# Altium schematic sheet pca10143_sheet3_interface_mcu.SchDoc: PCA10143 - Interface MCU
size A3; Organization: Nordic Semiconductor; DocumentNumber: 3; Revision: 0.7.2; SheetNumber: 3; SheetTotal: 7; CompanyName: Nordic Semiconductor
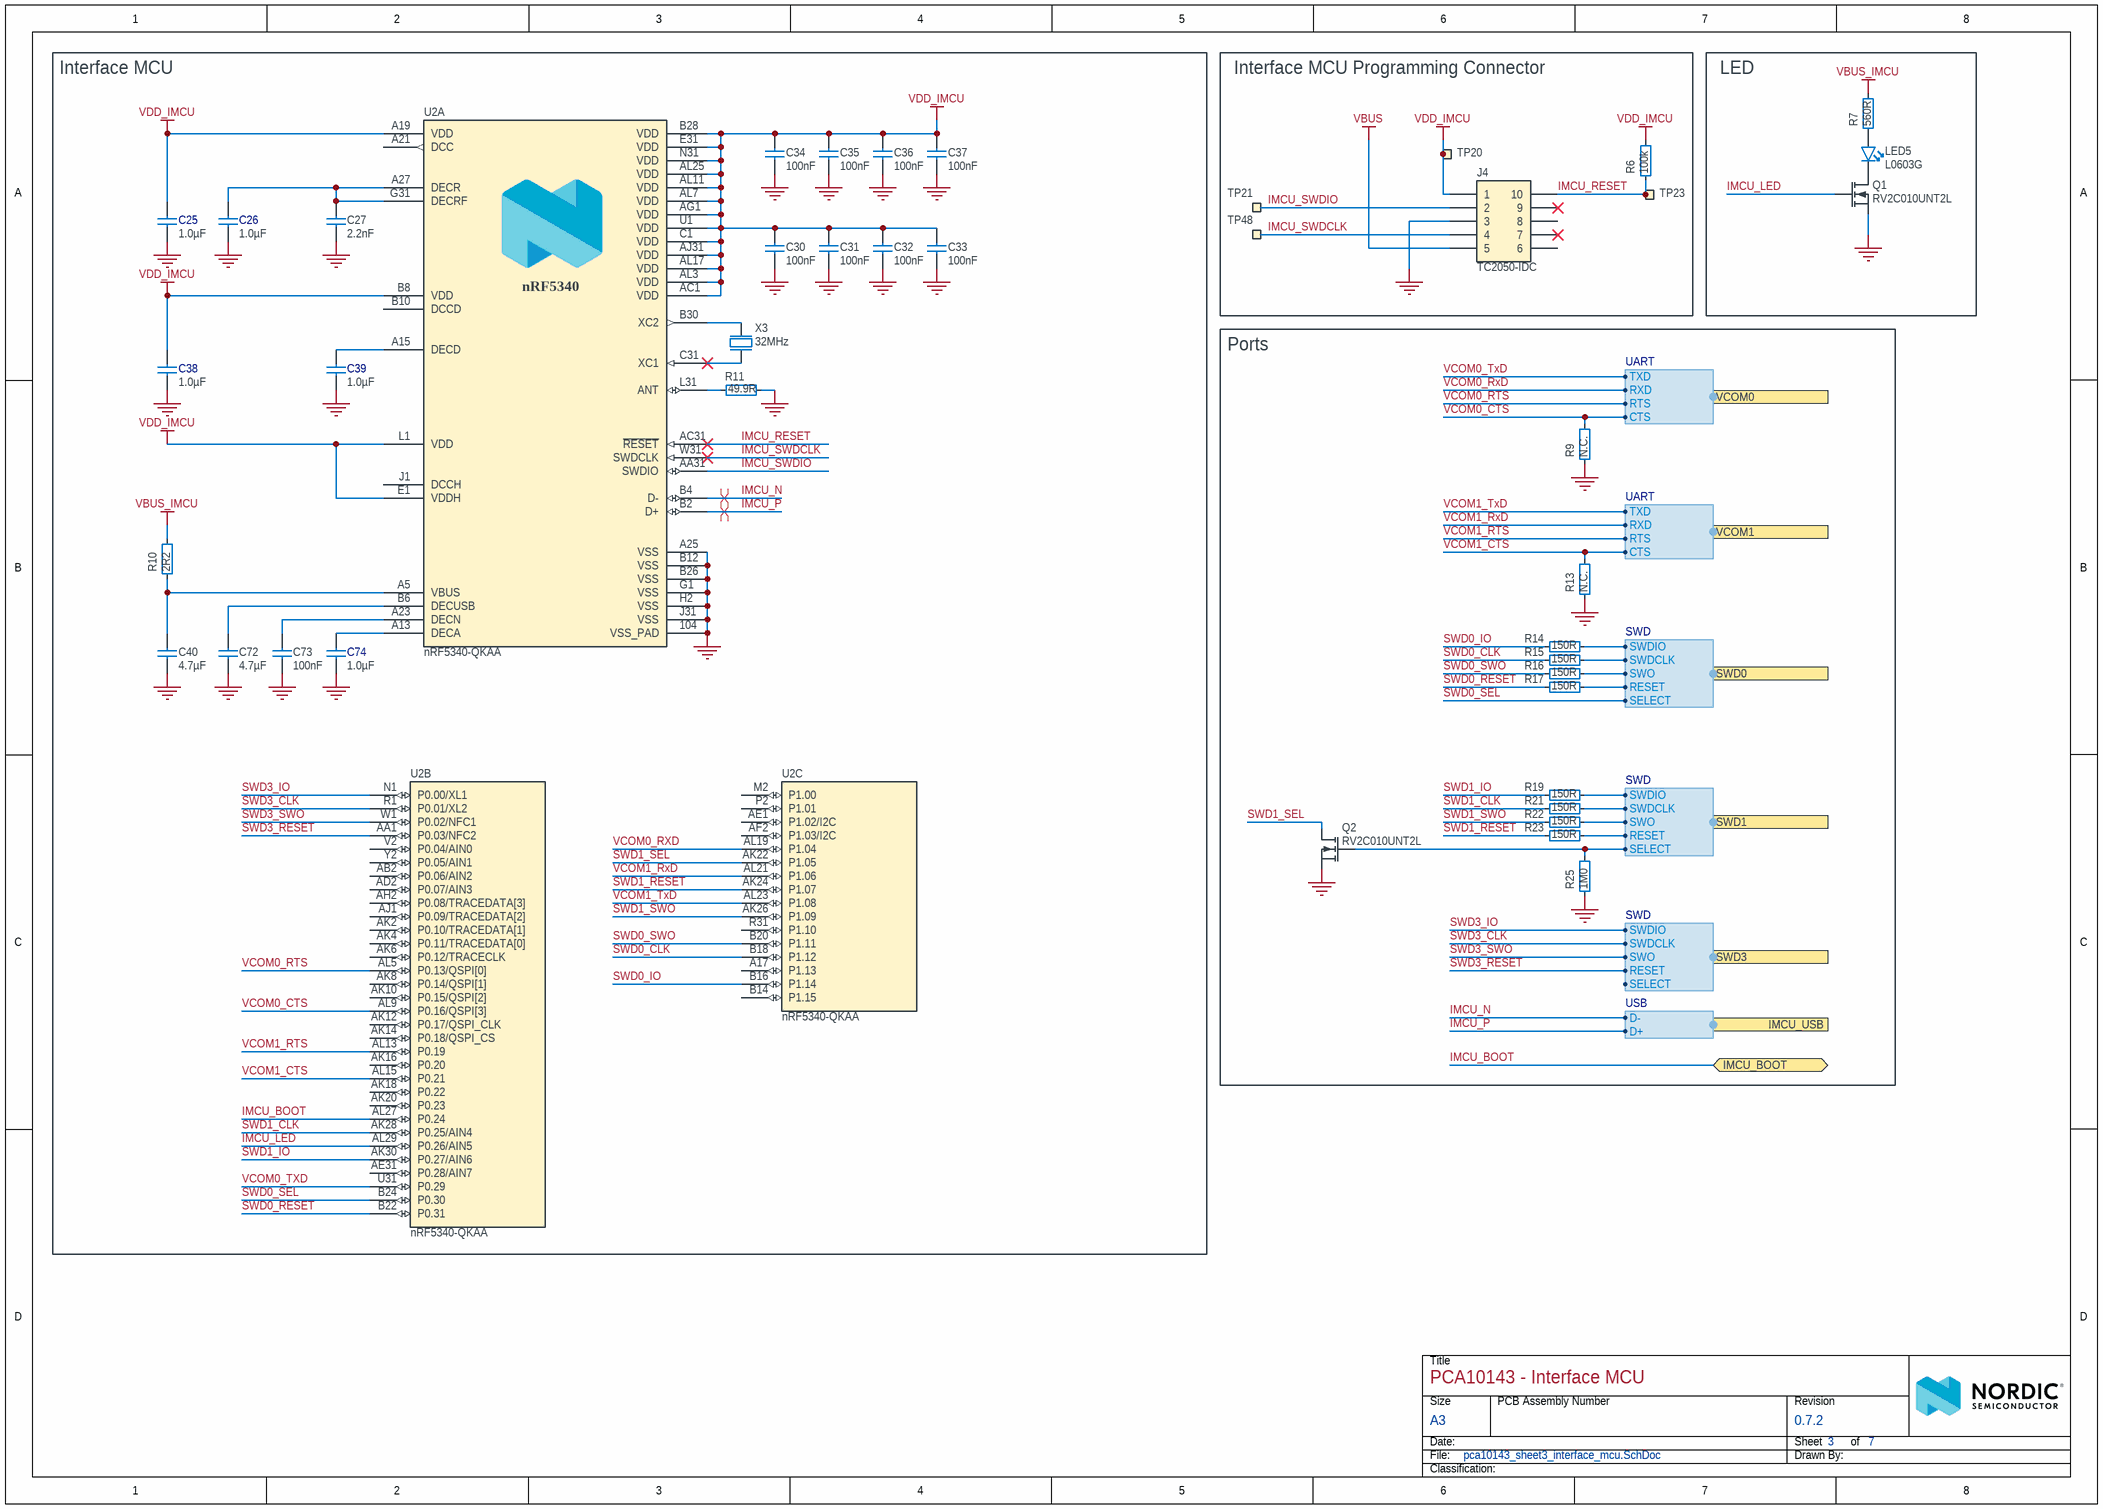
[diagram p0: pca10143_sheet3_interface_mcu.SchDoc]

## Parts
C25  1.0µF  [CAPC1005X04L]
C26  1.0µF  [CAPC1005X04L]
C27  2.2nF  [CAPC0603X03L_C]
C30  100nF  [CAPC0603X03L_C]
C31  100nF  [CAPC0603X03L_C]
C32  100nF  [CAPC0603X03L_C]
C33  100nF  [CAPC0603X03L_C]
C34  100nF  [CAPC0603X03L_C]
C35  100nF  [CAPC0603X03L_C]
C36  100nF  [CAPC0603X03L_C]
C37  100nF  [CAPC0603X03L_C]
C38  1.0µF  [CAPC1005X04L]
C39  1.0µF  [CAPC1005X04L]
C40  4.7µF  [CAPC1608X06L]
C72  4.7µF  [CAPC1608X06L]
C73  100nF  [CAPC0603X03L_C]
C74  1.0µF  [CAPC1005X04L]
J4  TC2050-IDC  [TC2050-IDC-NLFP]  (no BOM)
LED5  L0603G  [LED_0603_G]
Q1  RV2C010UNT2L  [DFN65P100X40-3L]
Q2  RV2C010UNT2L  [DFN65P100X40-3L]
R6  100k  [RESC0603X03L_C]
R7  560R  [RESC0603X03L_C]
R9  N.C.  [RESC0603X03L_C_NC]
R10  2R2  [RESC0603X03L_C]
R11  49.9R  [RESC0603X03L_C]
R13  N.C.  [RESC0603X03L_C_NC]
R14  150R  [RESC0603X03L_C]
R15  150R  [RESC0603X03L_C]
R16  150R  [RESC0603X03L_C]
R17  150R  [RESC0603X03L_C]
R19  150R  [RESC0603X03L_C]
R21  150R  [RESC0603X03L_C]
R22  150R  [RESC0603X03L_C]
R23  150R  [RESC0603X03L_C]
R25  1M0  [RESC0603X03L_C]
TP20  Ø1.5mm,SMD  [TP_SMD_D1.5mm]  (value not drawn)  (no BOM)
TP21  Ø1.5mm,SMD  [TP_SMD_D1.5mm]  (value not drawn)  (no BOM)
TP23  Ø1.5mm,SMD  [TP_SMD_D1.5mm]  (value not drawn)  (no BOM)
TP48  Ø1.5mm,SMD  [TP_SMD_D1.5mm]  (value not drawn)  (no BOM)
U2  nRF5340-QKAA  [AQFN40P700X700X85_HS-99N]  (parts A,B,C of 3)
X3  32MHz  [BT-XTAL_2016]

## Blocks framed on the sheet
Interface MCU: C25-C27 C30-C40 C72-C74 R10 R11 U2 X3
Interface MCU Programming Connector: J4 R6 TP20 TP21 TP23 TP48
LED: LED5 Q1 R7
Ports: Q2 R9 R13-R17 R19 R21-R23 R25

## Ports
IMCU_BOOT (bidir), IMCU_USB (harness USB), SWD0 (harness SWD), SWD1 (harness SWD), SWD3 (harness SWD), VCOM0 (harness UART), VCOM1 (harness UART)

## Harnesses
SWD: SWDIO, SWDCLK, SWO, RESET, SELECT
UART: RTS, CTS, RXD, TXD
USB: D+, D-

## Nets
GND: C25.2 C26.1 C27.2 C30.2 C31.2 C32.2 C33.2 C34.2 C35.2 C36.2 C37.2 C38.1 C39.1 C40.2 C72.2 C73.2 C74.1 J4.3 Q1.2(S) Q2.2(S) R9.2 R11.2 R13.2 R25.2 U2.104(VSS_PAD) U2.A25(VSS) U2.B12(VSS) U2.B26(VSS) U2.G1(VSS) U2.H2(VSS) U2.J31(VSS) X3.2(GND) X3.4(GND)
VBUS: J4.5
VBUS_IMCU: R7.2 R10.1
VDD_IMCU: C25.1 C30.1 C31.1 C32.1 C33.1 C34.1 C35.1 C36.1 C37.1 C38.2 J4.1 R6.2 TP20.1 U2.A19(VDD) U2.AC1(VDD) U2.AG1(VDD) U2.AJ31(VDD) U2.AL3(VDD) U2.AL7(VDD) U2.AL11(VDD) U2.AL17(VDD) U2.AL25(VDD) U2.B8(VDD) U2.B28(VDD) U2.C1(VDD) U2.E1(VDDH) U2.E31(VDD) U2.L1(VDD) U2.N31(VDD) U2.U1(VDD)
IMCU_BOOT: U2.AL27(P0.24) ; port IMCU_BOOT
IMCU_LED: Q1.1(G) U2.AL29(P0.26/AIN5)
IMCU_N: U2.B4(D-) ; port IMCU_USB.D-
IMCU_P: U2.B2(D+) ; port IMCU_USB.D+
IMCU_RESET: J4.10 R6.1 TP23.1 U2.AC31(~{RESET})
IMCU_SWDCLK: J4.4 TP48.1 U2.W31(SWDCLK)
IMCU_SWDIO: J4.2 TP21.1 U2.AA31(SWDIO)
SWD0_CLK: R15.1 U2.B18(P1.12)
SWD0_IO: R14.1 U2.B16(P1.14)
SWD0_RESET: R17.1 U2.B22(P0.31)
SWD0_SEL: U2.B24(P0.30) ; port SWD0.SELECT
SWD0_SWO: R16.1 U2.B20(P1.11)
SWD1_CLK: R21.1 U2.AK28(P0.25/AIN4)
SWD1_IO: R19.1 U2.AK30(P0.27/AIN6)
SWD1_RESET: R23.1 U2.AK24(P1.07)
SWD1_SEL: Q2.3(D) U2.AK22(P1.05)
SWD1_SWO: R22.1 U2.AK26(P1.09)
SWD3_CLK: U2.R1(P0.01/XL2) ; port SWD3.SWDCLK
SWD3_IO: U2.N1(P0.00/XL1) ; port SWD3.SWDIO
SWD3_RESET: U2.AA1(P0.03/NFC2) ; port SWD3.RESET
SWD3_SWO: U2.W1(P0.02/NFC1) ; port SWD3.SWO
VCOM0_CTS: R9.1 U2.AL9(P0.16/QSPI[3]) ; port VCOM0.CTS
VCOM0_RTS: U2.AL5(P0.13/QSPI[0]) ; port VCOM0.RTS
VCOM0_RXD: U2.AL19(P1.04) ; port VCOM0.RXD
VCOM0_TXD: U2.U31(P0.29) ; port VCOM0.TXD
VCOM1_CTS: R13.1 U2.AL15(P0.21) ; port VCOM1.CTS
VCOM1_RTS: U2.AL13(P0.19) ; port VCOM1.RTS
VCOM1_RxD: U2.AL21(P1.06) ; port VCOM1.RXD
VCOM1_TxD: U2.AL23(P1.08) ; port VCOM1.TXD
NetC26_2: C26.2 C27.1 U2.A27(DECR) U2.G31(DECRF)
NetC39_2: C39.2 U2.A15(DECD)
NetC40_1: C40.1 R10.2 U2.A5(VBUS)
NetC72_1: C72.1 U2.B6(DECUSB)
NetC73_1: C73.1 U2.A23(DECN)
NetC74_2: C74.2 U2.A13(DECA)
NetLED5_1: LED5.1(C) Q1.3(D)
NetLED5_2: LED5.2(A) R7.1
NetQ2_1: Q2.1(G) R25.1 ; port SWD1.SELECT
NetR11_1: R11.1 U2.L31(ANT)
NetR14_2: R14.2 ; port SWD0.SWDIO
NetR15_2: R15.2 ; port SWD0.SWDCLK
NetR16_2: R16.2 ; port SWD0.SWO
NetR17_2: R17.2 ; port SWD0.RESET
NetR19_2: R19.2 ; port SWD1.SWDIO
NetR21_2: R21.2 ; port SWD1.SWDCLK
NetR22_2: R22.2 ; port SWD1.SWO
NetR23_2: R23.2 ; port SWD1.RESET
NetU2_B30: U2.B30(XC2) X3.3(out)
NetU2_C31: U2.C31(XC1) X3.1(inp)

Not connected (* = marked no-connect by the designer): J4 6 7* 8 9*; U2 A17(P1.13) A21(DCC) AB2(P0.06/AIN2) AD2(P0.07/AIN3) AE1(P1.02/I2C) AE31(P0.28/AIN7) AF2(P1.03/I2C) AG31(N.C.) AH2(P0.08/TRACEDATA[3]) AJ1(P0.09/TRACEDATA[2]) AK2(P0.10/TRACEDATA[1]) AK4(P0.11/TRACEDATA[0]) AK6(P0.12/TRACECLK) AK8(P0.14/QSPI[1]) AK10(P0.15/QSPI[2]) AK12(P0.17/QSPI_CLK) AK14(P0.18/QSPI_CS) AK16(P0.20) AK18(P0.22) AK20(P0.23) B10(DCCD) B14(P1.15) D2(N.C.) F2(N.C.) J1(DCCH) M2(P1.00) P2(P1.01) R31(P1.10) T2(N.C.) V2(P0.04/AIN0) Y2(P0.05/AIN1)

## Layout directives
differential pair: IMCU_N, IMCU_P

## Notes on the sheet
- Title
- Size
- Date:
- File:
- A3
- PCB Assembly Number
- Sheet         of
- Drawn By:
- Revision
- Classification:
- (in symbol nRF5340-QKAAD0, part A) nRF5340

## Library data of the parts
C25 C26 C38 C39 C74 = C0402-1µ0-6.3V-X5R-5%: Capacitor, X5R, ±5%, 6.3V; Manufacturer: N.A.; Part number IPS: 00000007786, 00000003457; Part number NEMS: 100200190; Pad Count: 2; Artikkelnr Noca: 20039235; Component Status: Active; Part Number: C0402-1µ0-6.3V-X5R-5%; Value: 1.0µF; Footprint Doc: 0402; Component Class: Capacitors; Author: rsk; PartId: 100200190; Manufacturer Part Number: N.A.; ComponentLink1URL: N.A.; ComponentLink1Description: Datasheet; ComponentLink2URL: N.A.; ComponentLink2Description: Supplier link; HelpURL: N.A.; LatestRevisionDate: 2021-07-22; Published: 2009-05-08; Note: 6.3V; Supplier 1: Digi-Key; Supplier Part Number 1: 1276-1444-1-ND; Supplier 2: N.A.; Supplier Part Number 2: N.A.; Part number Norautron: N.A.
C27 = C0201-2n2: Capacitor, X7R, ±10%, 10V; Manufacturer: N.A.; Part number IPS: 00000001778; Part number Norautron: 26470002; Part number NEMS: 100200060; Pad Count: 2; Component Status: Active; Part Number: C0201-2n2; Value: 2.2nF; Footprint Doc: 0201; Component Class: Capacitors; Author: rsk; PartId: 100200060; Manufacturer Part Number: N.A.; ComponentLink1URL: N.A.; ComponentLink1Description: Datasheet; ComponentLink2URL: N.A.; ComponentLink2Description: Supplier link; HelpURL: N.A.; LatestRevisionDate: 2014-11-13; Published: 2014-11-13; Note: 10V; Supplier 1: N.A.; Supplier Part Number 1: N.A.; Supplier 2: N.A.; Supplier Part Number 2: N.A.; Artikkelnr Noca: N.A.
C30-C37 C73 = C0201-100n: Capacitor, X5R, ±10%; Manufacturer: N.A.; Part number IPS: 00000001248, 00000002505; Part number Norautron: 262071862; Part number NEMS: 100200078; Pad Count: 2; Note: 16V; Component Status: Active; Part Number: C0201-100n; Value: 100nF; Footprint Doc: 0201; Component Class: Capacitors; Author: rsk; PartId: 100200078; Manufacturer Part Number: N.A.; ComponentLink1URL: N.A.; ComponentLink1Description: Datasheet; ComponentLink2URL: N.A.; ComponentLink2Description: Supplier link; HelpURL: N.A.; LatestRevisionDate: 2017-11-09; Published: 2014-11-13; Supplier 1: N.A.; Supplier Part Number 1: N.A.; Supplier 2: N.A.; Supplier Part Number 2: N.A.; Artikkelnr Noca: N.A.
C40 = C0603-4µ7-10V-X7S: Capacitor, X7S, ±10%, 10V; Manufacturer: N.A.; Part number IPS: 00000001779; Part number NEMS: 100200351; Pad Count: 2; Artikkelnr Noca: 20030013; Component Status: Active; Part Number: C0603-4µ7-10V-X7S; Value: 4.7µF; Footprint Doc: 0603; Component Class: Capacitors; Author: rsk; PartId: 100200351; Manufacturer Part Number: N.A.; ComponentLink1URL: N.A.; ComponentLink1Description: Datasheet; ComponentLink2URL: N.A.; ComponentLink2Description: Supplier link; HelpURL: N.A.; LatestRevisionDate: 2016-08-15; Published: 2016-08-15; Note: 10V; Supplier 1: Digi-Key; Supplier Part Number 1: 445-14258-1-ND; Supplier 2: N.A.; Supplier Part Number 2: N.A.; Part number Norautron: N.A.
C72 = C0603-4µ7-6.3V-X7R: Capacitor, X7R, ±10%, 6.3V; Manufacturer: Samsung Electro-Mechanics America; Manufacturer Part Number: CL10B475KQ8NQNC; Part number IPS: 00000002541; Part number Norautron: N.A.; Part number NEMS: 100200350; Pad Count: 2; Artikkelnr Noca: 20039473; Component Status: Active; Part Number: C0603-4µ7-6.3V-X7R; Value: 4.7µF; Footprint Doc: 0603; Component Class: Capacitors; Author: rsk; PartId: 100200350; ComponentLink1URL: N.A.; ComponentLink1Description: Datasheet; ComponentLink2URL: N.A.; ComponentLink2Description: Supplier link; HelpURL: http://media.digikey.com/pdf/Data%20Sheets/Samsung%20PDFs/CL10B475KQ8NQNC_Spec.pdf; LatestRevisionDate: 2015-06-10; Published: 2015-06-10; Note: 6.3V; Supplier 1: Digi-Key; Supplier Part Number 1: 1276-2087-1-ND; Supplier 2: N.A.; Supplier Part Number 2: N.A.
J4 = TC2050-IDC-NLFP: CBL PLUG-OF-NAILS 10-PIN; Manufacturer: Tag-Connect LLC; Part number NEMS: 100500463; Artikkelnr Noca: N.A.; Pad Count: 10; Component Status: Active; Part Number: TC2050-IDC-NLFP; Manufacturer Part Number: TC2050-IDC-NLFP; LatestRevisionDate: 2012-11-21; Published: 2012-11-21; Value: TC2050-IDC; Footprint Doc: TC2050-IDC-NLFP; Part number IPS: N.A.; ComponentLink1URL: N.A.; ComponentLink1Description: Datasheet; ComponentLink2URL: N.A.; ComponentLink2Description: Supplier link; HelpURL: http://www.tag-connect.com/Materials/TC2050-IDC%20Datasheet.pdf; Supplier 1: Digi-Key; Supplier Part Number 1: TC2050-IDC-NL-ND; Supplier 2: N.A.; Supplier Part Number 2: N.A.; Component Class: Connectors; Note: N.A.; PartId: 100500463; Author: rsk; Part number Norautron: N.A.
LED5 = VS 25C7M5: LED, Green, 0603, 573nm, Vf=2.0V, 24mcd, - 40 to +85°C; Manufacturer: Victory Electronics; Part number IPS: 00000001274, 00000009961; Part number Norautron: 26313411; Part number NEMS: 101400097; Note: N.A.; Artikkelnr Noca: 13019193; Pad Count: 2; Component Status: Active; Part Number: VS 25C7M5; Manufacturer Part Number: VS 25C7M5; Footprint Doc: 0603; LatestRevisionDate: 2020-10-23; Published: 2017-08-21; Value: L0603G; ComponentLink1URL: N.A.; ComponentLink1Description: Datasheet; ComponentLink2URL: N.A.; ComponentLink2Description: Supplier link; HelpURL: \\hizz\pro\app9717\Datasheet\optoelectronics\Victory Electronics\VS 25C7M5.pdf; Supplier 1: EC Partner; Supplier Part Number 1: N.A.; Supplier 2: N.A.; Supplier Part Number 2: N.A.; PartId: 101400097; Component Class: Optoelectronics; Author: rsk
Q1 Q2 = RV2C010UNT2L: N-Channel MOSFET, 20V, 1A, 470mOhm, 400mW; Manufacturer: Rohm Semiconductor; Part number IPS: 00000009976; Part number Norautron: 26320026; Part number NEMS: 101300132; Note: N.A.; Artikkelnr Noca: 35010020; Pad Count: 3; Component Status: Active; Part Number: RV2C010UNT2L; Manufacturer Part Number: RV2C010UNT2L; ComponentLink1URL: N.A.; ComponentLink1Description: Datasheet; ComponentLink2URL: N.A.; ComponentLink2Description: Supplier link; HelpURL: http://rohmfs.rohm.com/en/products/databook/datasheet/discrete/transistor/mosfet/rv2c010unt2l-e.pdf; Footprint Doc: DFN-3; LatestRevisionDate: 2016-08-09; Published: 2016-08-09; Value: RV2C010UNT2L; Supplier 1: Digi-Key; Supplier Part Number 1: RV2C010UNT2LCT-ND; Supplier 2: Mouser; Supplier Part Number 2: 755-RV2C010UNT2L; PartId: 101300132; Component Class: Semiconductors; Author: rsk
R6 = R0201-100k: Resistor, ±1%, 0.05W; Manufacturer: N.A.; Part number IPS: 00000001419; Part number Norautron: 26108487; Part number NEMS: 100100080; Note: Chip Res 1%; Pad Count: 2; Component Status: Active; Part Number: R0201-100k; Manufacturer Part Number: N.A.; ComponentLink1URL: N.A.; ComponentLink1Description: Datasheet; ComponentLink2URL: N.A.; ComponentLink2Description: Supplier link; HelpURL: N.A.; Footprint Doc: 0201; LatestRevisionDate: 2014-11-13; Published: 2014-11-13; Value: 100k; Artikkelnr Noca: N.A.; Supplier 1: N.A.; Supplier Part Number 1: N.A.; Supplier 2: N.A.; Supplier Part Number 2: N.A.; Component Class: Resistors; PartId: 100100080; Author: rsk
R7 = R0201-560: Resistor, ±1%, 0.05W; Manufacturer: N.A.; Part number NEMS: 100100038; Note: Chip Res 1%; Pad Count: 2; Component Status: Active; Part Number: R0201-560; Manufacturer Part Number: N.A.; ComponentLink1URL: N.A.; ComponentLink1Description: Datasheet; ComponentLink2URL: N.A.; ComponentLink2Description: Supplier link; HelpURL: N.A.; Footprint Doc: 0201; LatestRevisionDate: 2014-11-13; Published: 2014-11-13; Value: 560R; Supplier 1: N.A.; Supplier Part Number 1: N.A.; Supplier 2: N.A.; Supplier Part Number 2: N.A.; Artikkelnr Noca: N.A.; Part number IPS: N.A.; PartId: 100100038; Component Class: Resistors; Author: rsk; Part number Norautron: N.A.
R9 R13 = R0201-N.C.: Not mounted; Manufacturer: N.A.; Part number NEMS: 100100107; Assembly: Not mounted; Note: Chip Res; Pad Count: 2; Component Status: Active; Part Number: R0201-N.C.; Manufacturer Part Number: N.A.; ComponentLink1URL: N.A.; ComponentLink1Description: Datasheet; ComponentLink2URL: N.A.; ComponentLink2Description: Supplier link; HelpURL: N.A.; Footprint Doc: 0201; LatestRevisionDate: 2014-11-13; Published: 2014-11-13; Value: N.C.; Supplier 1: N.A.; Supplier Part Number 1: N.A.; Supplier 2: N.A.; Supplier Part Number 2: N.A.; Artikkelnr Noca: N.A.; Part number IPS: N.A.; PartId: 100100107; Component Class: Resistors; Author: rsk; Part number Norautron: N.A.
R10 = R0201-2R2: Resistor, ±1%, 0.05W; Manufacturer: N.A.; Part number Norautron: 26470029; Part number NEMS: 100100006; Pad Count: 2; Note: Chip Res 1%; Component Status: Active; Part Number: R0201-2R2; Footprint Doc: 0201; Value: 2R2; Component Class: Resistors; Author: rsk; PartId: 100100006; Manufacturer Part Number: N.A.; ComponentLink1URL: N.A.; ComponentLink1Description: Datasheet; ComponentLink2URL: N.A.; ComponentLink2Description: Supplier link; HelpURL: N.A.; LatestRevisionDate: 2014-11-13; Published: 2014-11-13; Supplier 1: N.A.; Supplier Part Number 1: N.A.; Supplier 2: N.A.; Supplier Part Number 2: N.A.; Artikkelnr Noca: N.A.; Part number IPS: N.A.
R11 = R0201-49R9: Resistor, ±1%, 0.05W; Manufacturer: N.A.; Part number Norautron: 26107071; Part number NEMS: 100100612; Pad Count: 2; Note: Chip Res 1%; Component Status: Active; Part Number: R0201-49R9; PartId: 100100612; Component Class: Resistors; Author: getr; Manufacturer Part Number: N.A.; ComponentLink1URL: N.A.; ComponentLink1Description: Datasheet; ComponentLink2URL: N.A.; ComponentLink2Description: Supplier link; HelpURL: N.A.; Footprint Doc: 0201; LatestRevisionDate: 2021-04-15; Published: 2021-04-15; Value: 49.9R; Supplier 1: N.A.; Supplier Part Number 1: N.A.; Supplier 2: N.A.; Supplier Part Number 2: N.A.; Artikkelnr Noca: N.A.; Part number IPS: N.A.
R14-R17 R19 R21-R23 = R0201-150: Resistor, ±1%, 0.05W; Manufacturer: N.A.; Part number IPS: 00000001420; Part number NEMS: 100100029; Note: Chip Res 1%; Pad Count: 2; Component Status: Active; Part Number: R0201-150; Manufacturer Part Number: N.A.; ComponentLink1URL: N.A.; ComponentLink1Description: Datasheet; ComponentLink2URL: N.A.; ComponentLink2Description: Supplier link; HelpURL: N.A.; Footprint Doc: 0201; LatestRevisionDate: 2014-11-13; Published: 2014-11-13; Value: 150R; Artikkelnr Noca: N.A.; Supplier 1: N.A.; Supplier Part Number 1: N.A.; Supplier 2: N.A.; Supplier Part Number 2: N.A.; PartId: 100100029; Component Class: Resistors; Author: rsk; Part number Norautron: N.A.
R25 = R0201-1M0: Resistor, ±1%, 0.05W; Manufacturer: N.A.; Part number IPS: 00000001418; Part number Norautron: 26107108; Part number NEMS: 100100093; Note: Chip Res 1%; Pad Count: 2; Component Status: Active; Part Number: R0201-1M0; Manufacturer Part Number: N.A.; ComponentLink1URL: N.A.; ComponentLink1Description: Datasheet; ComponentLink2URL: N.A.; ComponentLink2Description: Supplier link; HelpURL: N.A.; Footprint Doc: 0201; LatestRevisionDate: 2014-11-13; Published: 2014-11-13; Value: 1M0; Supplier 1: N.A.; Supplier Part Number 1: N.A.; Supplier 2: N.A.; Supplier Part Number 2: N.A.; Artikkelnr Noca: N.A.; PartId: 100100093; Component Class: Resistors; Author: rsk
TP20 TP21 TP23 TP48 = TP_SMD_Ø1.5MM: 1.5mm circular SMD testpad; Manufacturer: Nordic Semiconductor; Manufacturer Part Number: N.A.; Part number NEMS: 100500477; Pad Count: 1; Component Status: Active; Part Number: TP_SMD_Ø1.5MM; ComponentLink1URL: N.A.; ComponentLink1Description: Datasheet; ComponentLink2URL: N.A.; ComponentLink2Description: Supplier link; HelpURL: N.A.; Footprint Doc: TP_SMD_Ø1.5mm; LatestRevisionDate: 2021-03-05; Published: 2016-06-02; Value: Ø1.5mm,SMD; Note: N.A.; Artikkelnr Noca: N.A.; Part number IPS: N.A.; Supplier 1: N.A.; Supplier Part Number 1: N.A.; Supplier 2: N.A.; Supplier Part Number 2: N.A.; Component Class: Connectors; PartId: 100500477; Author: rsk; Part number Norautron: N.A.
U2 = nRF5340-QKAAD0: Multi-protocol Bluetooth Low Energy, IEEE 802.15.4, ANT and 2.4GHz proprietary system-on-chip; Manufacturer: Nordic Semiconductor; Part number Norautron: NOD26470035; Part number NEMS: 102000216; Pad Count: 98; Note: N.A.; Component Status: Active; Part Number: nRF5340-QKAAD0; Footprint Doc: AQFN-98; Value: nRF5340-QKAA; Component Class: nRF_Devices; Author: rsk; PartId: 102000216; Manufacturer Part Number: nRF5340-QKAAD0; ComponentLink1URL: N.A.; ComponentLink1Description: Datasheet; ComponentLink2URL: N.A.; ComponentLink2Description: Supplier link; HelpURL: N.A.; LatestRevisionDate: 2020-12-02; Published: 2020-12-02; Supplier 1: Nordic Semiconductor; Supplier Part Number 1: nRF5340-QKAAD0; Supplier 2: N.A.; Supplier Part Number 2: N.A.; Artikkelnr Noca: N.A.; Part number IPS: N.A.
X3 = XTAL_SMD2016_32MHz_8pF_Kyocera_SA: XTAL SMD 2016, 32MHz, Cl=8pF, ±30ppm, -40°C ~ 105°C; Manufacturer Part Number: CX2016SA32000D0WRQG1; Part number NEMS: 101600100; Component Status: Active; Pad Count: 4; Note: XTAL SMD 32.000MHz; Artikkelnr Noca: N.A.; Part Number: XTAL_SMD2016_32MHz_8pF_Kyocera_SA; Component Class: Oscillators; Author: hany; Manufacturer: Kyocera; ComponentLink1URL: N.A.; ComponentLink1Description: Datasheet; ComponentLink2URL: N.A.; ComponentLink2Description: Supplier link; HelpURL: N.A.; LatestRevisionDate: 2022-09-19; Published: 2022-09-19; Footprint Doc: XTAL_2016; Value: 32MHz; Supplier 1: N.A.; Supplier Part Number 1: N.A.; Supplier 2: N.A.; Supplier Part Number 2: N.A.; Part number IPS: N.A.; Part number Norautron: N.A.; PartId: 101600100